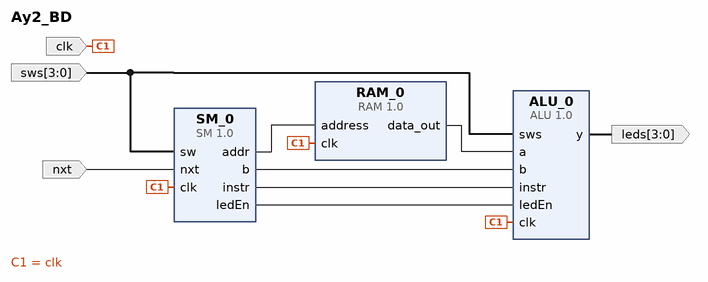
[diagram p0: block diagram of the top level]
# Vivado block design Ay2_BD, xc7z010clg400-1, Vivado 2020.1
create_bd_design Ay2_BD

create_bd_port -dir I -from 3 -to 0 sws
create_bd_port -dir I nxt
create_bd_port -dir I -type clk clk
create_bd_port -dir O -from 3 -to 0 leds

create_bd_cell -type ip -vlnv xilinx.com:user:SM:1.0 SM_0
create_bd_cell -type ip -vlnv xilinx.com:user:RAM:1.0 RAM_0
create_bd_cell -type ip -vlnv xilinx.com:user:ALU:1.0 ALU_0

# ---- connections ----

connect_bd_net -net sw_0_1 [get_bd_ports sws] [get_bd_pins SM_0/sw] [get_bd_pins ALU_0/sws]
connect_bd_net -net nxt_0_1 [get_bd_ports nxt] [get_bd_pins SM_0/nxt]
connect_bd_net -net clk_0_1 [get_bd_ports clk] [get_bd_pins SM_0/clk] [get_bd_pins RAM_0/clk] [get_bd_pins ALU_0/clk]
connect_bd_net [get_bd_pins SM_0/addr] [get_bd_pins RAM_0/address]
connect_bd_net [get_bd_pins SM_0/b] [get_bd_pins ALU_0/b]
connect_bd_net [get_bd_pins RAM_0/data_out] [get_bd_pins ALU_0/a]
connect_bd_net [get_bd_pins SM_0/instr] [get_bd_pins ALU_0/instr]
connect_bd_net [get_bd_pins SM_0/ledEn] [get_bd_pins ALU_0/ledEn]
connect_bd_net [get_bd_pins ALU_0/y] [get_bd_ports leds]

validate_bd_design
save_bd_design
